# Altium schematic sheet Shift_register_schematic.SchDoc
size A4; SheetNumber: 1; SheetTotal: 1
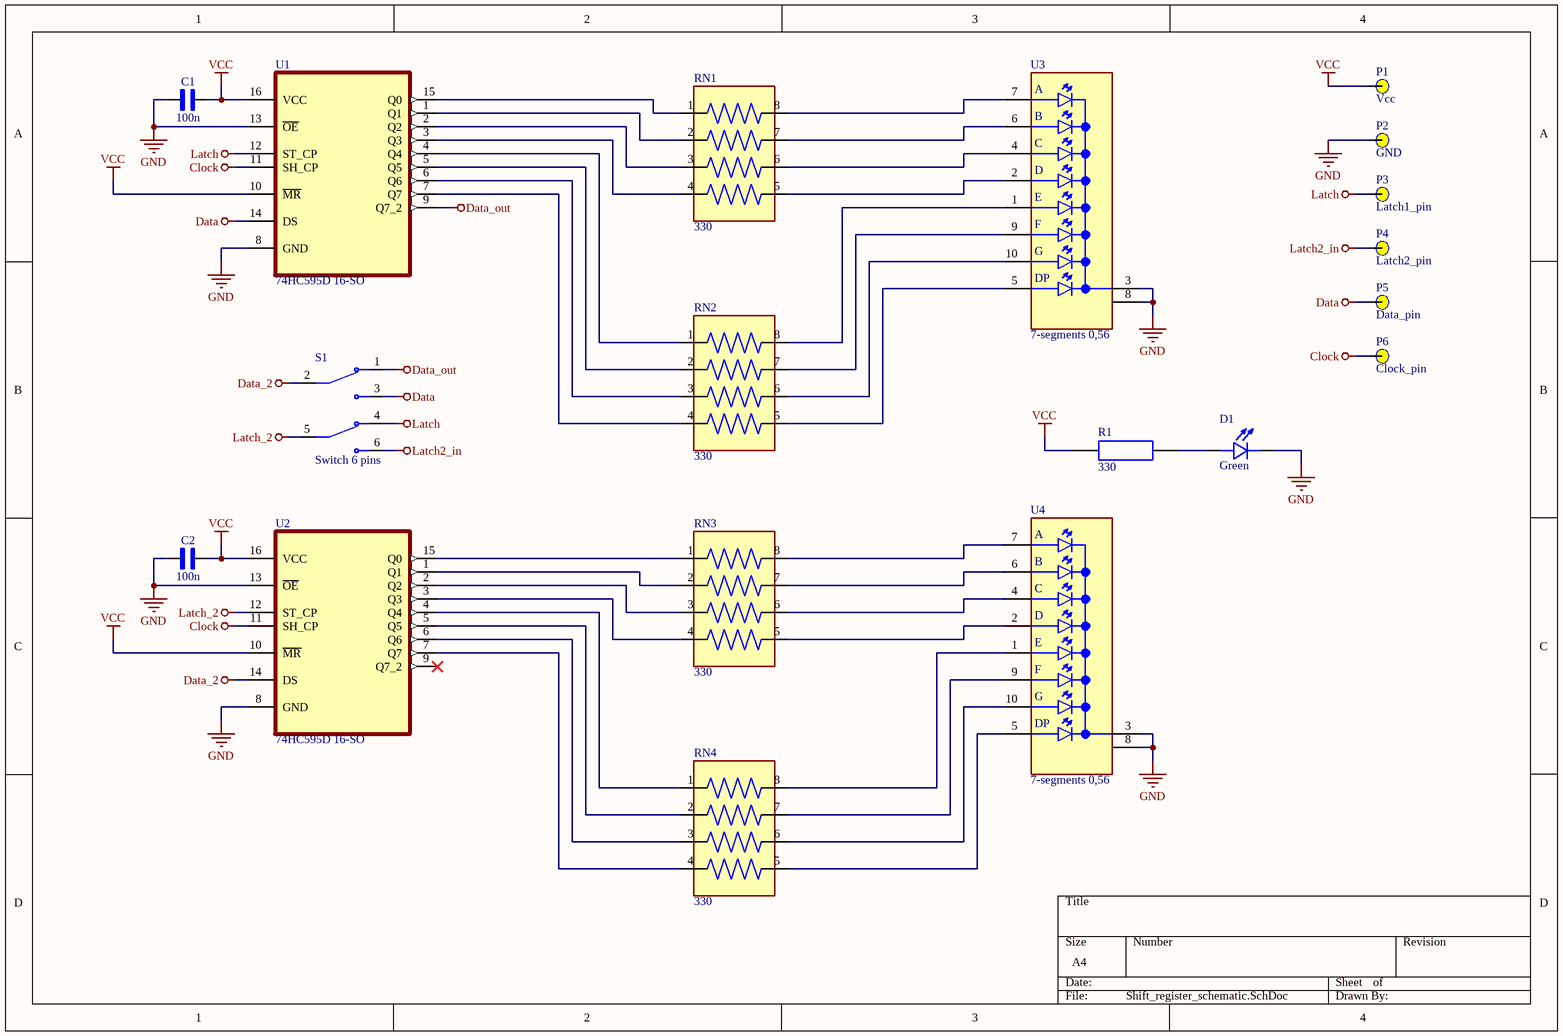
[diagram p0: Shift_register_schematic.SchDoc]

## Parts
C1  100n  [Capacitor 1206]
C2  100n  [Capacitor 1206]
D1  Green  [LED 1206]
P1  Vcc  [PCB_Pin_1]  (no BOM)
P2  GND  [PCB_Pin_1]  (no BOM)
P3  Latch1_pin  [PCB_Pin_1]  (no BOM)
P4  Latch2_pin  [PCB_Pin_1]  (no BOM)
P5  Data_pin  [PCB_Pin_1]  (no BOM)
P6  Clock_pin  [PCB_Pin_1]  (no BOM)
R1  330  [Resistor 1206]
RN1  330  [Resistor array 1206]
RN2  330  [Resistor array 1206]
RN3  330  [Resistor array 1206]
RN4  330  [Resistor array 1206]
S1  Switch 6 pins  [Switch 6 pins]
U1  74HC595D 16-SO  [74HC595 SO-16]
U2  74HC595D 16-SO  [74HC595 SO-16]
U3  7-segments 0,56  [7-segments 0,56]
U4  7-segments 0,56  [7-segments 0,56]

## Nets
Clock: P6.0(Pin) U1.11(SH_CP) U2.11(SH_CP)
Data: P5.0(Pin) S1.3 U1.14(DS)
Data_2: S1.2 U2.14(DS)
Data_out: S1.1 U1.9(Q7_2)
GND: C1.1 C2.1 D1.C P2.0(Pin) U1.8(GND) U1.13(~{OE}) U2.8(GND) U2.13(~{OE}) U3.3(CC) U3.8(CC) U4.3(CC) U4.8(CC)
Latch: P3.0(Pin) S1.4 U1.12(ST_CP)
Latch2_in: P4.0(Pin) S1.6
Latch_2: S1.5 U2.12(ST_CP)
VCC: C1.2 C2.2 P1.0(Pin) R1.1 U1.10(~{MR}) U1.16(VCC) U2.10(~{MR}) U2.16(VCC)
NetD1_A: D1.A R1.2
NetRN1_1: RN1.1 U1.15(Q0)
NetRN1_2: RN1.2 U1.1(Q1)
NetRN1_3: RN1.3 U1.2(Q2)
NetRN1_4: RN1.4 U1.3(Q3)
NetRN1_5: RN1.5 U3.2(D)
NetRN1_6: RN1.6 U3.4(C)
NetRN1_7: RN1.7 U3.6(B)
NetRN1_8: RN1.8 U3.7(A)
NetRN2_1: RN2.1 U1.4(Q4)
NetRN2_2: RN2.2 U1.5(Q5)
NetRN2_3: RN2.3 U1.6(Q6)
NetRN2_4: RN2.4 U1.7(Q7)
NetRN2_5: RN2.5 U3.5(DP)
NetRN2_6: RN2.6 U3.10(G)
NetRN2_7: RN2.7 U3.9(F)
NetRN2_8: RN2.8 U3.1(E)
NetRN3_1: RN3.1 U2.15(Q0)
NetRN3_2: RN3.2 U2.1(Q1)
NetRN3_3: RN3.3 U2.2(Q2)
NetRN3_4: RN3.4 U2.3(Q3)
NetRN3_5: RN3.5 U4.2(D)
NetRN3_6: RN3.6 U4.4(C)
NetRN3_7: RN3.7 U4.6(B)
NetRN3_8: RN3.8 U4.7(A)
NetRN4_1: RN4.1 U2.4(Q4)
NetRN4_2: RN4.2 U2.5(Q5)
NetRN4_3: RN4.3 U2.6(Q6)
NetRN4_4: RN4.4 U2.7(Q7)
NetRN4_5: RN4.5 U4.5(DP)
NetRN4_6: RN4.6 U4.10(G)
NetRN4_7: RN4.7 U4.9(F)
NetRN4_8: RN4.8 U4.1(E)

Not connected (* = marked no-connect by the designer): U2 9(Q7_2)*

## Library data of the parts
C1 C2 = Capacitor 1206: MF: AVX; MP: 12061C225K4T2A; SnapEDA_Link: https://www.snapeda.com/parts/12061C225K4T2A/AVX/view-part/?ref=snap; Package: 3216 AVX; Value: *; Check_prices: https://www.snapeda.com/parts/12061C225K4T2A/AVX/view-part/?ref=eda
D1 = LED 1206: MF: Lite-On Inc.; MP: LTST-C230KGKT; SnapEDA_Link: https://www.snapeda.com/parts/LTST-C230KGKT/Lite-On/view-part/?ref=snap; Package: 1206 Lite-On; Value: *; Check_prices: https://www.snapeda.com/parts/LTST-C230KGKT/Lite-On/view-part/?ref=eda
P1-P6 = PIN_1
R1 = Resistor 1206: MP: ERJU08F4703V; Package: None; Price: None; Availability: Unavailable; Value: *
RN1-RN4 = Resistor array 1206: Resistor,Thick Film,Networks & Arrays,330 Ohm,5%,8 Pin | Bourns CAY16-331J4LF; SnapEDA_Link: https://www.snapeda.com/parts/CAY16-331J4LF/Bourns/view-part/?ref=snap; Package: NON STANDARD-8 Bourns; Value: *; MF: Bourns; MP: CAY16-331J4LF; Check_prices: https://www.snapeda.com/parts/CAY16-331J4LF/Bourns/view-part/?ref=eda
S1 = Switch 6 pins: Switch MSK-22D18G2; MF: E-Switch; MP: TL2201EEZA; SnapEDA_Link: https://www.snapeda.com/parts/TL2201EEZA/E-Switch/view-part/?ref=snap; Package: None; Value: *; Check_prices: https://www.snapeda.com/parts/TL2201EEZA/E-Switch/view-part/?ref=eda
U1 U2 = 74HC595D 16-SO: Shift Shift Register 1 Element 8 Bit 16-SO; MF: NXP USA; MP: 74HC595D/AUJ; SnapEDA_Link: https://www.snapeda.com/parts/74HC595D/AUJ/NXP+Semiconductors/view-part/?ref=snap; Package: SOIC-16 ON Semiconductor; Value: *; Check_prices: https://www.snapeda.com/parts/74HC595D/AUJ/NXP+Semiconductors/view-part/?ref=eda
U3 U4 = 7-segments 0,56: .56IN. 7 SEGMENT SINGLE DISPLAY, 565NM GREEN, GRAY FACE, WHITE SEGMENTS, COMMON | Lumex LDS-C512RI; SnapEDA_Link: https://www.snapeda.com/parts/LDS-C512RI/Lumex/view-part/?ref=snap; Package: None; Value: *; MF: Lumex; MP: LDS-C512RI; Check_prices: https://www.snapeda.com/parts/LDS-C512RI/Lumex/view-part/?ref=eda